# Altium project LocalKill.PrjPcb
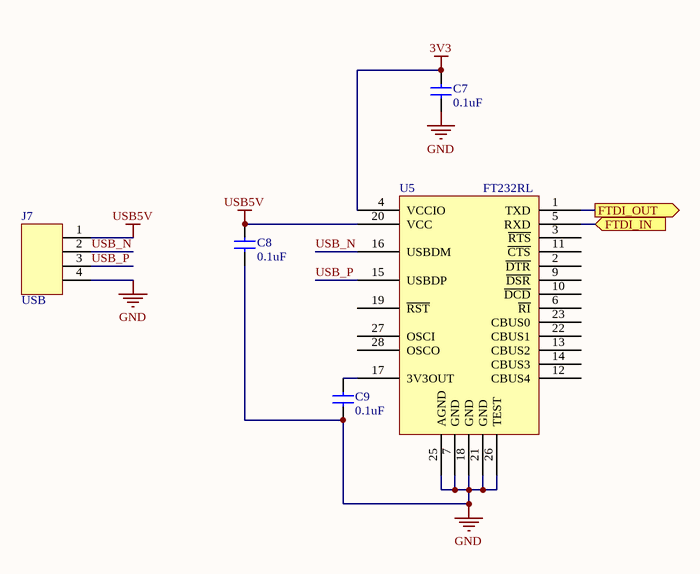
[diagram p0: USBtoUART.SchDoc]
2 sheets, 23 parts. Net scope: flat (ports and power ports of the same name join across sheets).
Board file: LocalKill.PcbDoc
Sheets:
  USBtoUART.SchDoc
  MCU.SchDoc

## Sheet USBtoUART.SchDoc
size A

### Parts
C7  value 0.1uF  [CAPC0603]  (hidden comment: Cap)
C8  value 0.1uF  [CAPC0603]  (hidden comment: Cap)
C9  value 0.1uF  [CAPC0603]  (hidden comment: Cap)
J7  USB  [MOLEX-HDR-1X4-SHERLOCK-VERT]
U5  FT232RL  [SSOP_28_N]

### Ports
FTDI_IN (in), FTDI_OUT (out)

### Nets
3V3: C7.1(A) U5.4(VCCIO)
GND: C7.2(B) C8.2(B) C9.2(B) J7.4 U5.7(GND) U5.18(GND) U5.21(GND) U5.25(AGND) U5.26(TEST)
USB5V: C8.1(A) J7.1 U5.20(VCC)
USB_N: J7.2 U5.16(USBDM)
USB_P: J7.3 U5.15(USBDP)
NetC9_1: C9.1(A) U5.17(3V3OUT)
NetU5_1: U5.1(TXD) ; port FTDI_OUT
NetU5_5: U5.5(RXD) ; port FTDI_IN

Not connected (* = marked no-connect by the designer): U5 2(~{DTR}) 3(~{RTS}) 6(~{RI}) 9(~{DSR}) 10(~{DCD}) 11(~{CTS}) 12(CBUS4) 13(CBUS2) 14(CBUS3) 19(~{RST}) 22(CBUS1) 23(CBUS0) 27(OSCI) 28(OSCO)

### Library data of the parts
J7 = MOLEX-HDR-1x4-SHERLOCK_VERT: Header, Molex, 2mm Pitch Sherlock Header, Single Row, Vertical, 4 Circuits, Length 3.3mm, 0353620450; Manufacturer Part Number: *; Order Part Number: *
U5 = FT232RL: IC USB FS SERIAL UART 28-SSOP; Supplier Part Number 1: 768-1007-1-ND; Supplier 1: Digi-Key
C7-C9 = Cap: Supplier 1: Digi-Key; Supplier Part Number 1: 1276-1000-1-ND

## Sheet MCU.SchDoc
size A
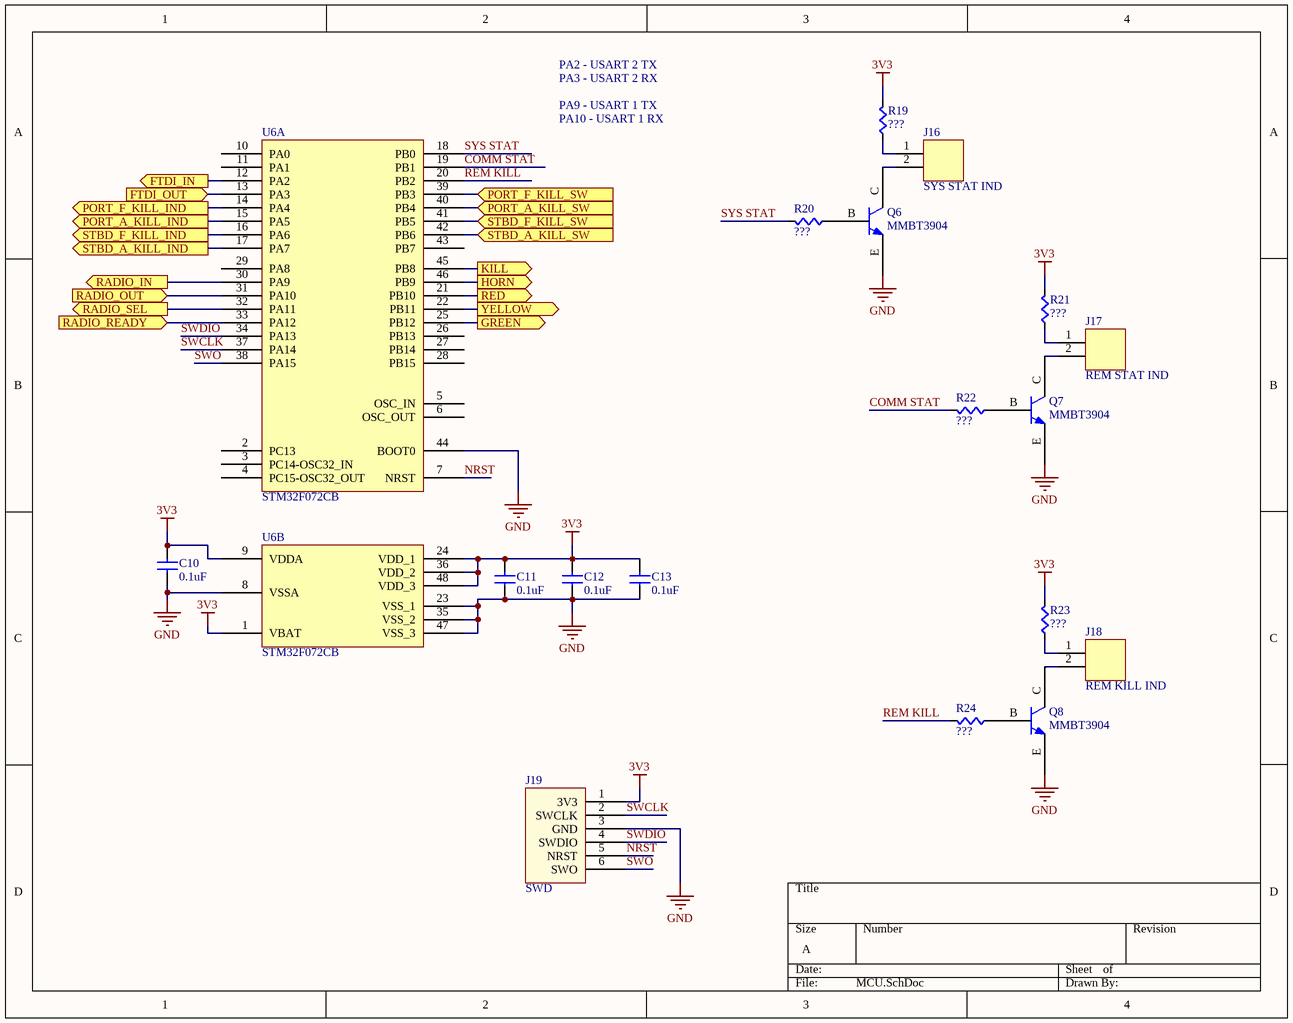
[diagram p1: MCU.SchDoc]

### Parts
C10  value 0.1uF  [CAPC0603]  (hidden comment: Cap)
C11  value 0.1uF  [CAPC0603]  (hidden comment: Cap)
C12  value 0.1uF  [CAPC0603]  (hidden comment: Cap)
C13  value 0.1uF  [CAPC0603]  (hidden comment: Cap)
J16  SYS STAT IND  [MOLEX-HDR-1X2-SHERLOCK-VERT]
J17  REM STAT IND  [MOLEX-HDR-1X2-SHERLOCK-VERT]
J18  REM KILL IND  [MOLEX-HDR-1X2-SHERLOCK-VERT]
J19  SWD  [SWD_STM32]
Q6  MMBT3904  [MMBT3904]
Q7  MMBT3904  [MMBT3904]
Q8  MMBT3904  [MMBT3904]
R19  value ???  [RES0603]  (hidden comment: Res)
R20  value ???  [RES0603]  (hidden comment: Res)
R21  value ???  [RES0603]  (hidden comment: Res)
R22  value ???  [RES0603]  (hidden comment: Res)
R23  value ???  [RES0603]  (hidden comment: Res)
R24  value ???  [RES0603]  (hidden comment: Res)
U6  STM32F072CB  [STM32F072CB]  (parts A,B of 2)

### Ports
FTDI_IN (out), FTDI_OUT (in), GREEN (out), HORN (out), KILL (out), PORT_A_KILL_IND (out), PORT_A_KILL_SW (in), PORT_F_KILL_IND (out), PORT_F_KILL_SW (in), RADIO_IN (out), RADIO_OUT (in), RADIO_READY (in), RADIO_SEL (out), RED (out), STBD_A_KILL_IND (out), STBD_A_KILL_SW (in), STBD_F_KILL_IND (out), STBD_F_KILL_SW (in), YELLOW (out)

### Nets
3V3: C10.1(A) C11.1(A) C12.1(A) C13.1(A) J19.1(3V3) R19.1(A) R21.1(A) R23.1(A) U6.1(VBAT) U6.9(VDDA) U6.24(VDD_1) U6.36(VDD_2) U6.48(VDD_3)
GND: C10.2(B) C11.2(B) C12.2(B) C13.2(B) J19.3(GND) Q6.E Q7.E Q8.E U6.8(VSSA) U6.23(VSS_1) U6.35(VSS_2) U6.44(BOOT0) U6.47(VSS_3)
COMM STAT: R22.1(A) U6.19(PB1)
NRST: J19.5(NRST) U6.7(NRST)
REM KILL: R24.1(A) U6.20(PB2)
SWCLK: J19.2(SWCLK) U6.37(PA14)
SWDIO: J19.4(SWDIO) U6.34(PA13)
SWO: J19.6(SWO) U6.38(PA15)
SYS STAT: R20.1(A) U6.18(PB0)
NetJ16_1: J16.1 R19.2(B)
NetJ16_2: J16.2 Q6.C
NetJ17_1: J17.1 R21.2(B)
NetJ17_2: J17.2 Q7.C
NetJ18_1: J18.1 R23.2(B)
NetJ18_2: J18.2 Q8.C
NetQ6_B: Q6.B R20.2(B)
NetQ7_B: Q7.B R22.2(B)
NetQ8_B: Q8.B R24.2(B)
NetU5_1: U6.13(PA3) ; port FTDI_OUT
NetU5_5: U6.12(PA2) ; port FTDI_IN
NetU6_14: U6.14(PA4) ; port PORT_F_KILL_IND
NetU6_15: U6.15(PA5) ; port PORT_A_KILL_IND
NetU6_16: U6.16(PA6) ; port STBD_F_KILL_IND
NetU6_17: U6.17(PA7) ; port STBD_A_KILL_IND
NetU6_21: U6.21(PB10) ; port RED
NetU6_22: U6.22(PB11) ; port YELLOW
NetU6_25: U6.25(PB12) ; port GREEN
NetU6_30: U6.30(PA9) ; port RADIO_IN
NetU6_31: U6.31(PA10) ; port RADIO_OUT
NetU6_32: U6.32(PA11) ; port RADIO_SEL
NetU6_33: U6.33(PA12) ; port RADIO_READY
NetU6_39: U6.39(PB3) ; port PORT_F_KILL_SW
NetU6_40: U6.40(PB4) ; port PORT_A_KILL_SW
NetU6_41: U6.41(PB5) ; port STBD_F_KILL_SW
NetU6_42: U6.42(PB6) ; port STBD_A_KILL_SW
NetU6_45: U6.45(PB8) ; port KILL
NetU6_46: U6.46(PB9) ; port HORN

Not connected (* = marked no-connect by the designer): U6 2(PC13) 3(PC14-OSC32_IN) 4(PC15-OSC32_OUT) 5(OSC_IN) 6(OSC_OUT) 10(PA0) 11(PA1) 26(PB13) 27(PB14) 28(PB15) 29(PA8) 43(PB7)

### Notes on the sheet
- PA2 - USART 2 TX
- PA3 - USART 2 RX
- PA9 - USART 1 TX
- PA10 - USART 1 RX

### Library data of the parts
J16-J18 = MOLEX-HDR-1x2-SHERLOCK_VERT: Header, Molex, 2mm Pitch Sherlock Header, Single Row, Vertical, 2 Circuits, Length 3.3mm, 0353620250; Manufacturer Part Number: *; Order Part Number: *
J19 = SWD_STM32: SWD connector matching the pinout on STM Discovery Boards
Q6-Q8 = MMBT3904: TRANS NPN 40V 0.2A SOT-23; Manufacturer 1: Fairchild Semiconductor; Supplier 1: Digi-Key; Supplier Part Number 1: MMBT3904FSCT-ND; Manufacturer Part Number 1: MMBT3904
U6 = STM32F072CB: MCU 32BIT 128KB FLASH 48LQFP; Supplier 1: Digi-Key; Supplier Part Number 1: 497-14645-ND
C10-C13 = Cap: Supplier 1: Digi-Key; Supplier Part Number 1: 1276-1000-1-ND
R19-R24 = Res: Supplier 1: Digi-Key; Supplier Part Number 1: RMCF0603JT10K0CT-ND

## Nets that join several sheets
3V3: USBtoUART (C7.1 U5.4), MCU (13 pins)
GND: USBtoUART (9 pins), MCU (13 pins)
NetU5_1: USBtoUART (U5.1), MCU (U6.13)
NetU5_5: USBtoUART (U5.5), MCU (U6.12)